# Altium schematic sheet power.SchDoc
size A4
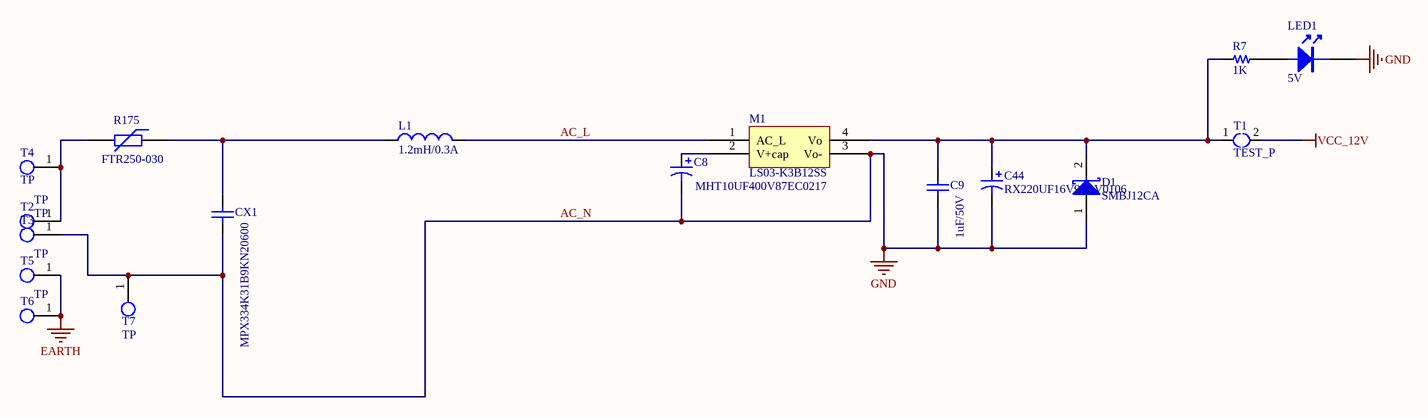
[diagram p0: power.SchDoc]

## Parts
C8  MHT10UF400V87EC0217  [CAP-TH_BD6.3-P2.50-D0.5-FD]
C9  1uF/50V  [1206C]
C44  RX220UF16V90RV0106  [CAP-SMD_BD6.3-L6.6-W6.6-FD-2]
CX1  MPX334K31B9KN20600  [CAP-TH_L10.0-W6.0-P7.50-D0.6]
D1  SMBJ12CA  [SMB]
L1  1.2mH/0.3A  [IND-TH_BD7.5-P3.00-D0.6]
LED1  5V  [0603LED]
M1  LS03-K3B12SS
R7  1K  [0603R]
R175  FTR250-030  [FUSE-TH_L6.0-W4.6-P5.10-D0.6-S4.00]
T1  TEST_P  [TEST_P]
T2  TP  [220V_Hole]
T3  TP  [220V_Hole]
T4  TP  [220V_Hole2]
T5  TP  [220V_Hole]
T6  TP  [220V_Hole2]
T7  TP  [220V_Hole2]

## Nets
AC_N: C8.2 C9.1 C44.2 CX1.1 D1.1(A) LED1.2 M1.3(Vo-) T3.1 T7.1  [also labelled GND]
EARTH: T5.1 T6.1
VCC_12V: T1.2
AC_L: L1.2 M1.1(AC_L)
NetC8_1: C8.1 M1.2(V+cap)
NetC9_2: C9.2 C44.1 D1.2(K) M1.4(Vo) R7.2 T1.1
NetCX1_2: CX1.2 L1.1 R175.1
NetLED1_1: LED1.1 R7.1
NetR175_2: R175.2 T2.1 T4.1

## Library data of the parts
C8 C44 = Cap Pol1: Polarized Capacitor (Radial); Value: 220uF/50V; Published: 8-Jun-2000; LatestRevisionDate: 17-Jul-2002; LatestRevisionNote: Re-released for DXP Platform.; PackageReference: RB7.6-15; Publisher: Altium Limited
C9 CX1 = Cap: Capacitor; Value: 22nF; Published: 8-Jun-2000; LatestRevisionDate: 17-Jul-2002; LatestRevisionNote: Re-released for DXP Platform.; PackageReference: RAD-0.3; Publisher: Altium Limited; PackageDescription: Radial Cap, Thru-Hole; 2 Leads; 0.3 in Pin Spacing
D1 = 1N5819HW-7-F: 1.0 A Surface Mount Schottky Barrier Rectifier, 40 V, -65 to 125 degC, 2-Pin SOD-123 Package, RoHS, Tape and Reel; Manufacturer: Diodes Inc; @ VR (V): 40; @ Terminal Temperature TT (degC): 90; Maximum Average Rectified Current IO (A): 1; Total Capacitance CT (pF): 50; Peak Forward Surge Current IFSM (A): 25; Forward Voltage Drop VF (V): 0.45; VR (RMS) (V): 28; RoHS: TRUE; PartNumber: 1N5819HW-7-F; ComponentLink2URL: http://www.diodes.com/datasheets/ds30217.pdf; PackageDescription: 2-Pin SOD-123, Body 2.7 x 1.55 mm, Pitch 3.7 mm; @ IF (A): 1; Operating and Storage Temperature Range: -65 to 125 degC; ComponentLink1Description: Manufacturer URL; ComponentLink2Description: Datasheet; ComponentLink1URL: http://www.diodes.com/; Mounting Technology: Surface Mount; DatasheetVersion: Rev. 15-2; PackageReference: SOD-123-2; Maximum Reverse Current IR (uA): 50; Peak Repetitive Reverse Voltage VRRM (V): 40; Packing: Tape and Reel
L1 = 1276AS-H-100M=P2: Metal alloy Power Inductor, 10 uH, ±20%, 1210 (3225); Manufacturer: Murata; DC Resistance: 0.71 Ohm; Inductance: 10 uH; Rated Current: 250 mA; ComponentLink1Description: Manufacturer URL; ComponentLink2Description: Datasheet; Mounting Technology: Surface Mount; ComponentLink1URL: http://www.murata.com/; PackageDescription: 2-Pin SMT Inductor, 3.2 x 2.5 mm Body; PackageReference: IND1210; PartNumber: 1276AS-H-100M=P2; ComponentLink2URL: http://www.murata.com/products/catalog/pdf/o05e.pdf#LQH32C
LED1 = LED
R7 = R
R175 = Res Varistor: Varistor (Voltage-Sensitive Resistor); Published: 24-Mar-1999; LatestRevisionDate: 29-May-2009; LatestRevisionNote: IPC-7351 Footprint Added.; PackageVersion: Mar-2003; PackageReference: 6-0805; Publisher: Altium Limited; PackageDescription: Chip Resistor 0805 Case Size; Code_IPC: RESC2012